# EAGLE design Mango (EAGLE 9.6.2)
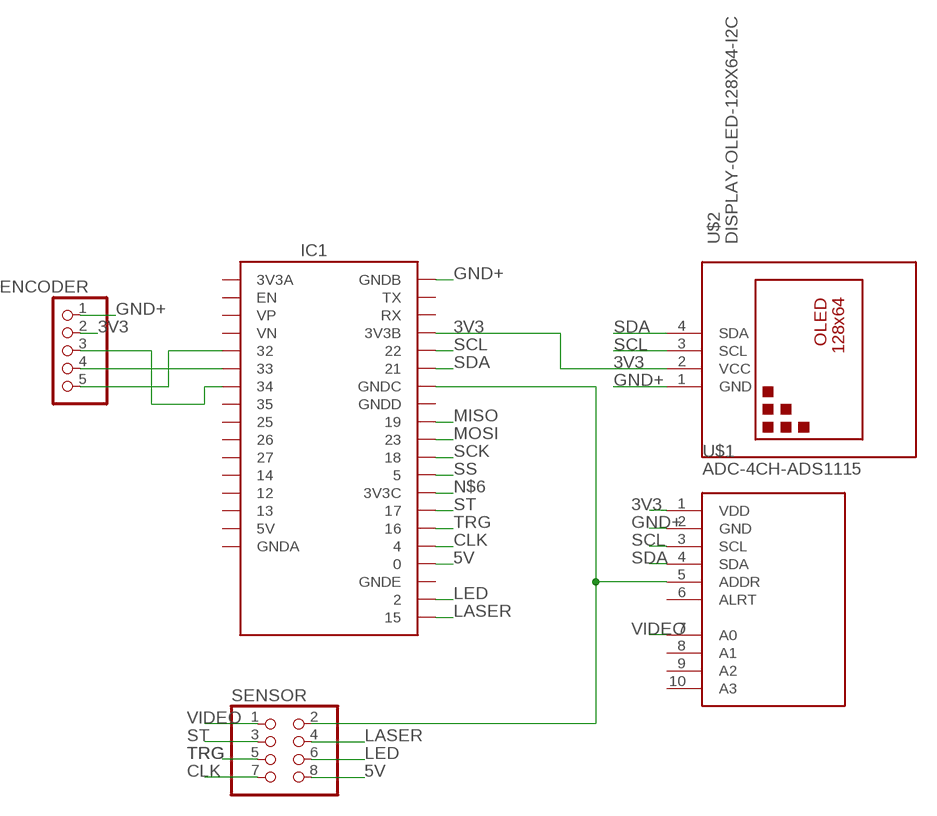
[diagram p0: schematic, sheet 1]

## Parts
ENCODER  PINHD-1X5  [1X05]
IC1  SSFD_LOLIN32_WEMOS_CHINA_W_BATT  [SSFD_LOLIN32_WEMOS_CHINA_W_BATT]
SENSOR  PINHD-2X4  [2X04]
U$1  ADC-4CH-ADS1115  [ADC-4CH-ADS1115]
U$2  DISPLAY-OLED-128X64-I2C  [DISPLAY-OLED-128X64-I2C]

## Nets
3V3: ENCODER.2 IC1.3V3B U$1.1(VDD) U$2.2(VCC)
5V: IC1.0 SENSOR.8
CLK: IC1.4 SENSOR.7
GND+: ENCODER.1 IC1.GNDB U$1.2(GND) U$2.1(GND)
LASER: IC1.15 SENSOR.4
LED: IC1.2 SENSOR.6
MISO: IC1.19
MOSI: IC1.23
N$1: ENCODER.5 IC1.32
N$2: ENCODER.3 IC1.34
N$3: ENCODER.4 IC1.33
N$6: IC1.3V3C
N$7: IC1.GNDC SENSOR.2 U$1.5(ADDR)
SCK: IC1.18
SCL: IC1.22 U$1.3(SCL) U$2.3(SCL)
SDA: IC1.21 U$1.4(SDA) U$2.4(SDA)
SS: IC1.5
ST: IC1.17 SENSOR.3
TRG: IC1.16 SENSOR.5
VIDEO: SENSOR.1 U$1.7(A0)
Unconnected: IC1.3V3A IC1.5V IC1.12 IC1.13 IC1.14 IC1.25 IC1.26 IC1.27 IC1.35 IC1.EN IC1.GNDA IC1.GNDD IC1.GNDE IC1.RX IC1.TX IC1.VN IC1.VP U$1.6(ALRT) U$1.8(A1) U$1.9(A2) U$1.10(A3)

## Library data of the parts
ENCODER = pinhead:PINHD-1X5: PIN HEADER
IC1 = SSFD - ESP32 WEMOS LOLIN CHINA W_BATT:SSFD_LOLIN32_WEMOS_CHINA_W_BATT: BY SEGASONICFAN DESIGNS HTTP://WWW.SEGASONICFAN.WIXSITE.COM/RETRO WEMOS ESP32 BREAKOUT 4MB CHINA WITH BATTERY CONNECTOR https://arduino-projekte.info/wemos-lolin32/ https://diyprojects.io/wemos-lolin32-new-development-board-esp32-e645-4mb-memory-lipo-battery-connector/
SENSOR = pinhead:PINHD-2X4: PIN HEADER
U$1 = diy-modules:ADC-4CH-ADS1115: 4 Channel 16-Bit Analog-to-Digital Converter based on ADS1115 chip Arduino ADS1115 Getting Started Tutorial is available here: http://henrysbench.capnfatz.com/henrys-bench/arduino-voltage-measurements/arduino-ads1115-module-getting-started-tutorial/ ADS1115 datasheet is available here: http://www.ti.com/lit/ds/symlink/ads1115.pdf Click here to find device on ebay.com <http://www.ebay.com/sch/ads1115+module>
U$2 = diy-modules:DISPLAY-OLED-128X64-I2C: 128x64 Dot Matrix OLED Module based on SSD1306 chip Variant with I2C interface More details available here: http://www.instructables.com/id/Monochrome-096-i2c-OLED-display-with-arduino-SSD13/ SSD1306 datasheet: https://cdn-shop.adafruit.com/datasheets/SSD1306.pdf Click here to find device on ebay.com <http://www.ebay.com/sch/oled+display+128x64+iic> Note: There are two variants: I2C and SPI. Search for the proper version.

## Net classes
0 default: width 0.8 mm, clearance 0.205 mm

## Board
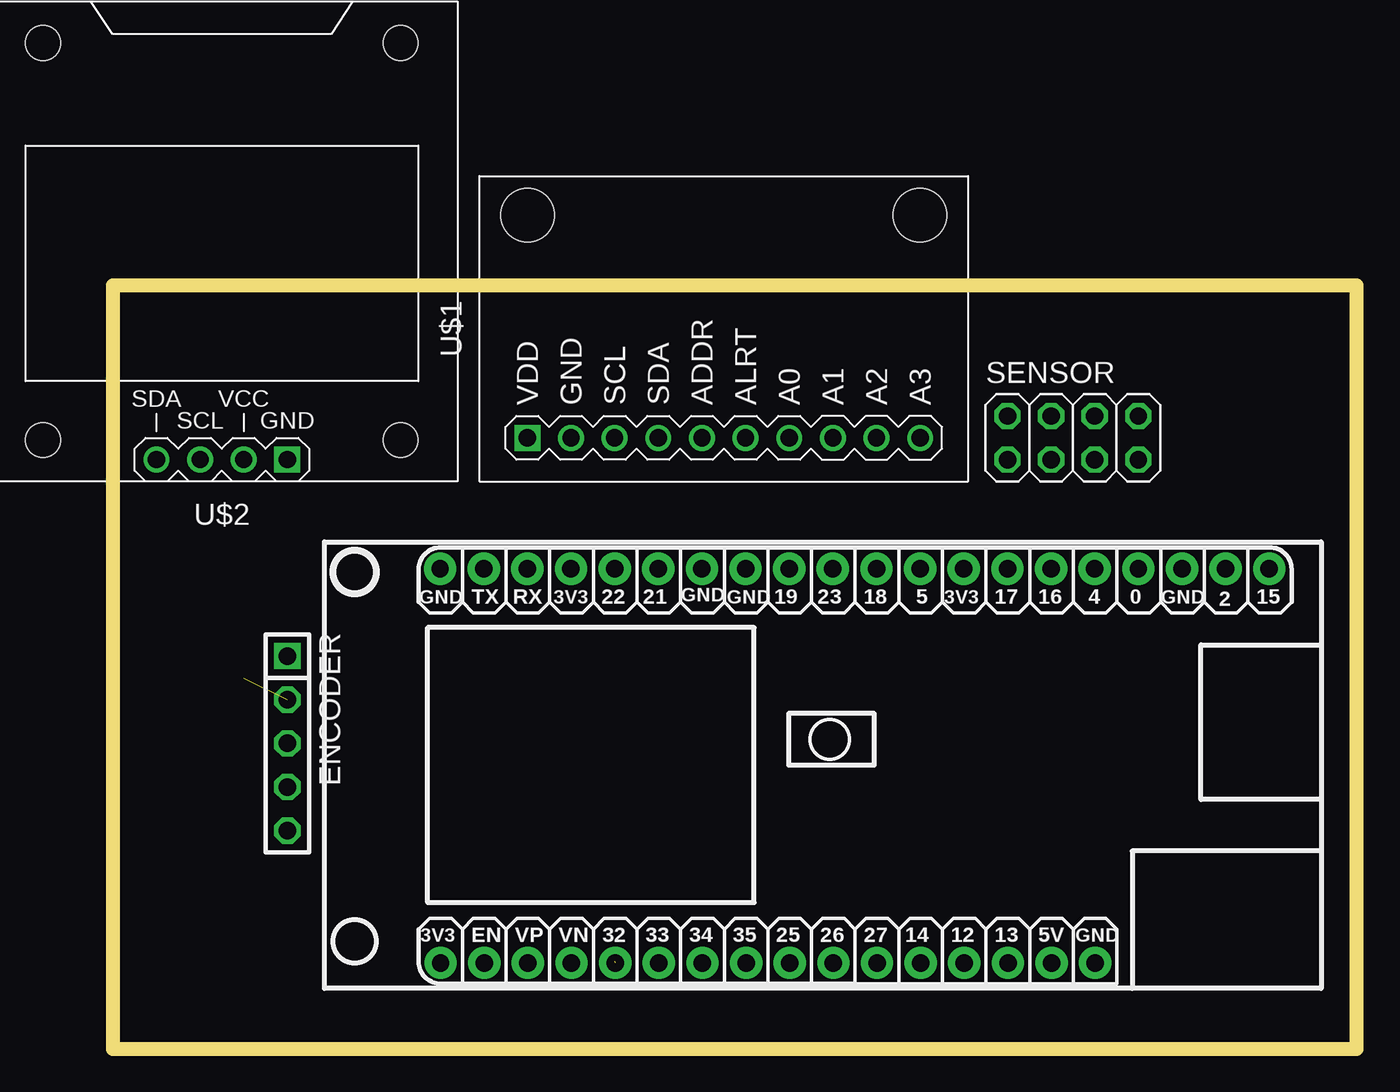
[diagram p1: board, top side]
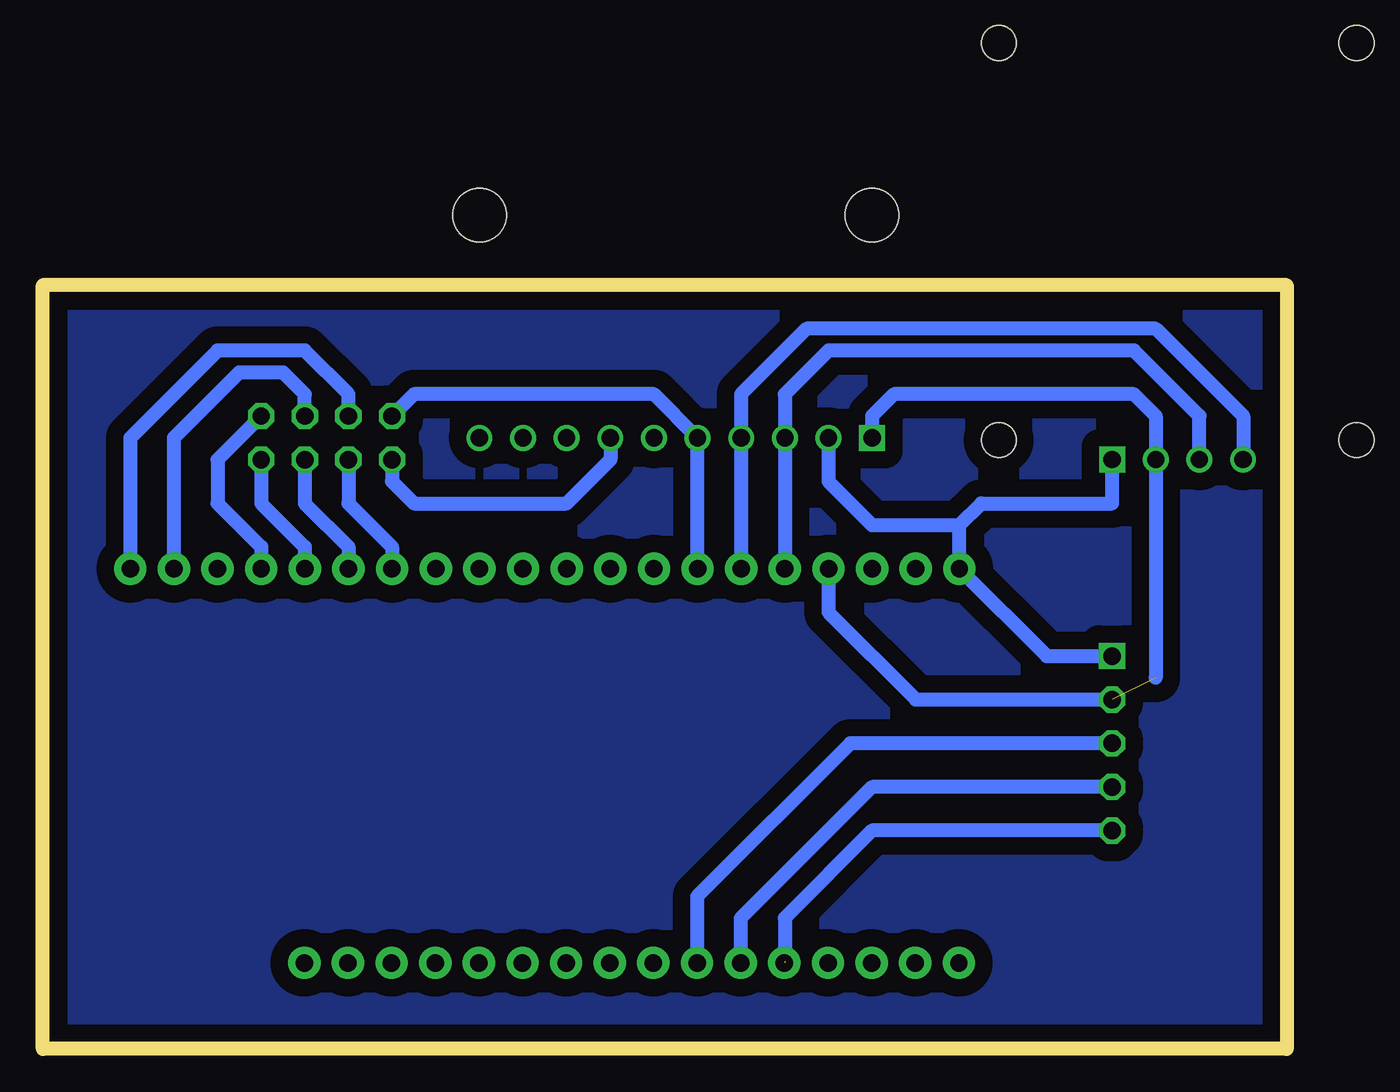
[diagram p2: board, bottom side, seen from below]

Size 72.39 x 44.45 mm. Coordinates in mm from the lower left corner, seen from the top.
Outline: 0,44.45 0,0 72.39,0 72.39,44.45 0,44.45
Copper layers (1*16): Top 0.035mm / dielectric 1.5mm / Bottom 0.035mm
Design rules "default": minimum track width 6mil, minimum drill 0.35mm, track to track 6mil, track to pad 6mil, pad to pad 6mil, via to via 6mil, smd to smd 6mil, copper to edge 40mil, drill to drill 6mil, minimum pad ring 10mil, minimum via ring 8mil, stop-mask expansion 4mil, vias tented up to drill 0mil, thermal gap 10mil

### Footprints (pad centres in the part's own frame; a part is rotated, then mirrored left to right if it is on the bottom)
1X05 = drill 1.016 square: 1 -5.08,0 | drill 1.016 octagon: 2 -2.54,0; 3 0,0; 4 2.54,0; 5 5.08,0
SSFD_LOLIN32_WEMOS_CHINA_W_BATT = drill 1.016 pad 1.88: 0 11.43,-22.86; 2 11.43,-27.94; 3V3A -11.51,17.75; 3V3B 11.43,10.16; 3V3C 11.43,-12.7; 4 11.43,-20.32; 5 11.43,-10.16; 5V -11.51,-17.81; 12 -11.51,-12.73; 13 -11.51,-15.27; 14 -11.51,-10.19; 15 11.43,-30.48; 16 11.43,-17.78; 17 11.43,-15.24; 18 11.43,-7.62; 19 11.43,-2.54; 21 11.43,5.08; 22 11.43,7.62; 23 11.43,-5.08; 25 -11.51,-2.57; 26 -11.51,-5.11; 27 -11.51,-7.65; 32 -11.51,7.59; 33 -11.51,5.05; 34 -11.51,2.51; 35 -11.51,-0.03; EN -11.51,15.21; GNDA -11.51,-20.35; GNDB 11.43,17.78; GNDC 11.43,2.54; GNDD 11.43,0; GNDE 11.43,-25.4; RX 11.43,12.7; TX 11.43,15.24; VN -11.51,10.13; VP -11.51,12.67
2X04 = drill 1.016 octagon: 1 -3.81,-1.27; 2 -3.81,1.27; 3 -1.27,-1.27; 4 -1.27,1.27; 5 1.27,-1.27; 6 1.27,1.27; 7 3.81,-1.27; 8 3.81,1.27
ADC-4CH-ADS1115 = drill 1 square: 1 -6.35,11.43 | drill 1: 2 -6.35,8.89; 3 -6.35,6.35; 4 -6.35,3.81; 5 -6.35,1.27; 6 -6.35,-1.27; 7 -6.35,-3.81; 8 -6.35,-6.35; 9 -6.35,-8.89; 10 -6.35,-11.43 | hole 3.1: 6.604,11.43; 6.604,-11.43
DISPLAY-OLED-128X64-I2C = drill 1 square: 1 -3.81,12.7 | drill 1: 2 -1.27,12.7; 3 1.27,12.7; 4 3.81,12.7 | hole 2: -10.414,11.557; 10.414,11.557; 10.414,-11.557; -10.414,-11.557

### Placement (x,y rotation side)
ENCODER  10.16,17.78 270 top
IC1  36.83,16.51 90 top
SENSOR  55.88,35.56 0 top
U$1  35.56,41.91 90 top
U$2  6.35,46.99 180 top

### Tracks (layer width: path | path; a pad name or v marks a point on that pad's centre or on a via)
3V3  (1 unrouted)
  Bottom 0.8: IC1.3V3B 26.67,25.4 21.59,20.32 ENCODER.2 | U$1.1 24.13,36.83 22.86,38.1 8.89,38.1 7.62,36.83 U$2.2 7.62,21.59
5V
  Bottom 0.8: IC1.0 59.69,29.21 62.23,31.75 62.23,34.29 SENSOR.8
CLK
  Bottom 0.8: SENSOR.7 59.69,31.75 57.15,29.21 IC1.4
GND
  pour Bottom (isolate 1.016): 1.27,43.18 71.12,43.18 71.12,1.27 1.27,1.27
GND+
  Bottom 0.8: U$1.2 26.67,33.02 24.13,30.48 19.05,30.48 | 19.05,30.48 IC1.GNDB 13.97,22.86 ENCODER.1 | U$2.1 10.16,31.75 17.78,31.75 19.05,30.48
LASER
  Bottom 0.8: SENSOR.4 54.61,38.1 57.15,40.64 62.23,40.64 67.31,35.56 IC1.15
LED
  Bottom 0.8: SENSOR.6 57.15,38.1 58.42,39.37 60.96,39.37 64.77,35.56 IC1.2
N$1  (1 unrouted)
  Bottom 0.8: ENCODER.5 24.13,12.7 29.21,7.62 29.21,5.08
N$2
  Bottom 0.8: ENCODER.3 25.4,17.78 34.32,8.86 IC1.34
N$3
  Bottom 0.8: ENCODER.4 24.13,15.24 31.78,7.59 IC1.33
N$7
  Bottom 0.8: IC1.GNDC U$1.5 36.83,38.1 50.8,38.1 SENSOR.2
SCL
  Bottom 0.8: IC1.22 U$1.3 29.21,38.1 26.67,40.64 8.89,40.64 5.08,36.83 U$2.3
SDA
  Bottom 0.8: IC1.21 U$1.4 31.75,38.1 27.94,41.91 7.62,41.91 2.54,36.83 U$2.4
ST
  Bottom 0.8: IC1.17 52.07,29.21 54.61,31.75 SENSOR.3
TRG
  Bottom 0.8: SENSOR.5 57.15,31.75 54.61,29.21 IC1.16
VIDEO
  Bottom 0.8: SENSOR.1 52.07,33.02 50.8,31.75 41.91,31.75 39.37,34.29 U$1.7